# EAGLE design ePro (EAGLE 9.6.2)
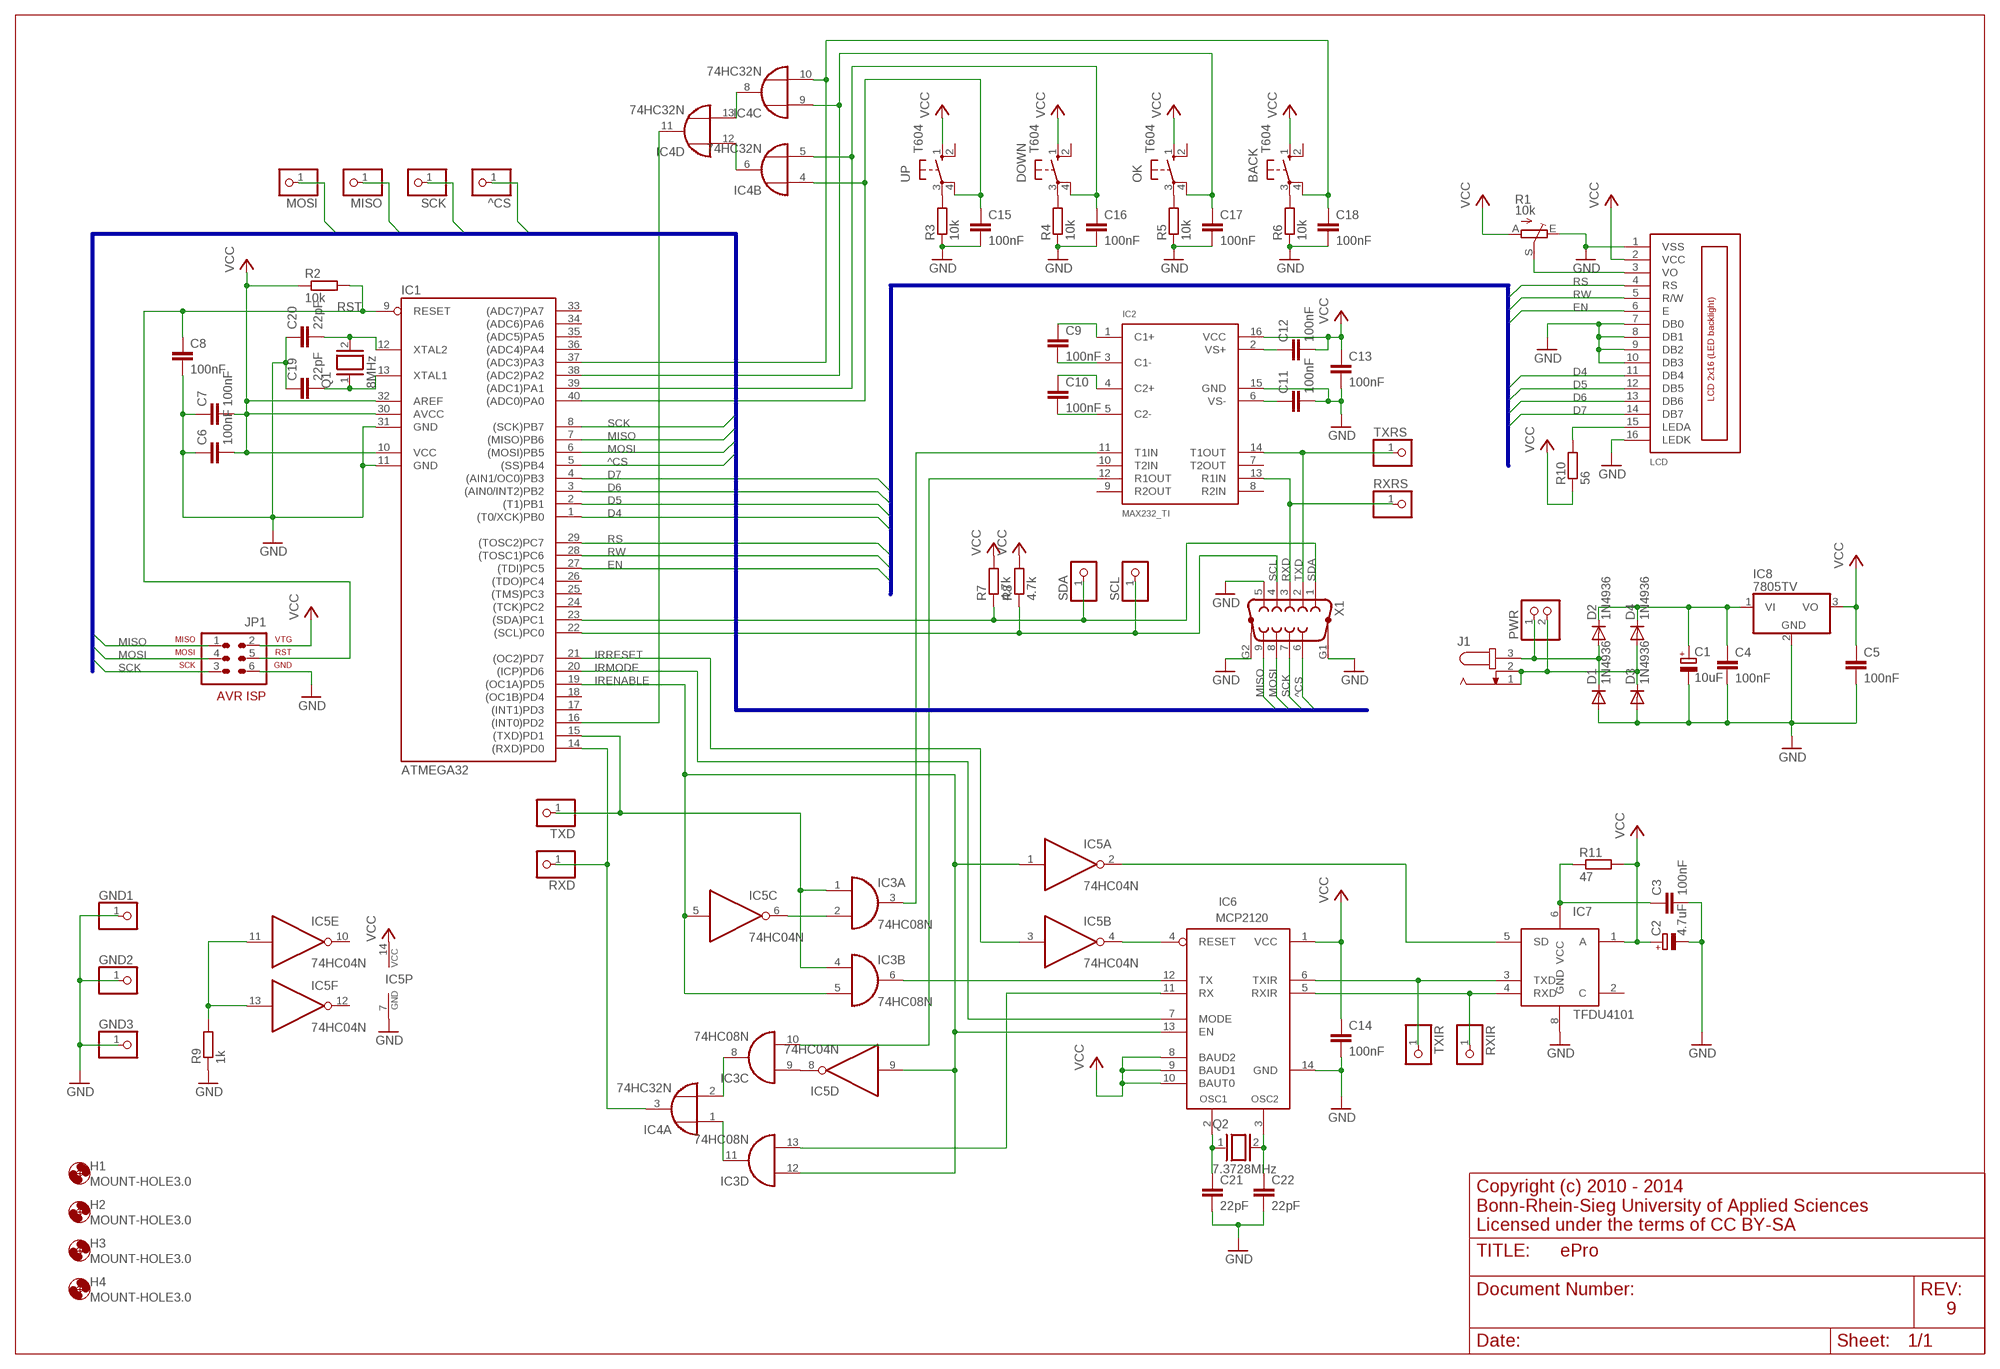
[diagram p0: schematic, sheet 1]

## Parts
^CS  PINHD-1X1  [1X01]
BACK  T604  [T602/604]
C1  10uF  CPOL-EUB45181B  [B45181B]
C2  4.7uF  CPOL-EUB45181B  [B45181B]
C3  100nF  C-EU025-024X044  [C025-024X044]
C4  100nF  C-EU025-024X044  [C025-024X044]
C5  100nF  C-EU025-024X044  [C025-024X044]
C6  100nF  C-EU025-024X044  [C025-024X044]
C7  100nF  C-EU025-024X044  [C025-024X044]
C8  100nF  C-EU025-024X044  [C025-024X044]
C9  100nF  C-EU025-024X044  [C025-024X044]
C10  100nF  C-EU025-024X044  [C025-024X044]
C11  100nF  C-EU025-024X044  [C025-024X044]
C12  100nF  C-EU025-024X044  [C025-024X044]
C13  100nF  C-EU025-024X044  [C025-024X044]
C14  100nF  C-EU025-024X044  [C025-024X044]
C15  100nF  C-EU025-024X044  [C025-024X044]
C16  100nF  C-EU025-024X044  [C025-024X044]
C17  100nF  C-EU025-024X044  [C025-024X044]
C18  100nF  C-EU025-024X044  [C025-024X044]
C19  22pF  C-EU025-024X044  [C025-024X044]
C20  22pF  C-EU025-024X044  [C025-024X044]
C21  22pF  C-EU025-024X044  [C025-024X044]
C22  22pF  C-EU025-024X044  [C025-024X044]
D1  1N4936  [DO41-10]
D2  1N4936  [DO41-10]
D3  1N4936  [DO41-10]
D4  1N4936  [DO41-10]
DOWN  T604  [T602/604]
GND1  PINHD-1X1  [1X01]
GND2  PINHD-1X1  [1X01]
GND3  PINHD-1X1  [1X01]
H1  MOUNT-HOLE3.0  [3,0]
H2  MOUNT-HOLE3.0  [3,0]
H3  MOUNT-HOLE3.0  [3,0]
H4  MOUNT-HOLE3.0  [3,0]
IC1  ATMEGA32  MEGA32-P  [DIL40]
IC2  MAX232_TI  [DIL16]
IC3  74HC08N  [DIL14]
IC4  74HC32N  [DIL14]
IC5  74HC04N  [DIL14]
IC6  MCP2120  MCP2120-P  [DIL14]
IC7  TFDU4101  [U]
IC8  7805TV  [TO220V]
J1  JACK-PLUG1  [SPC4078]
JP1  AVR-ISP-6  [AVR-ISP-6]
LCD  LCD_2X16_SIL  [HY-1602F]
MISO  PINHD-1X1  [1X01]
MOSI  PINHD-1X1  [1X01]
OK  T604  [T602/604]
PWR  PINHD-1X2  [1X02]
Q1  8MHz  XTAL/S  [QS]
Q2  7.3728MHz  XTAL/S  [QS]
R1  10k  TRIM_EU-PT10S  [PT-10S]
R2  10k  R-EU_0204/7  [0204/7]
R3  10k  R-EU_0204/7  [0204/7]
R4  10k  R-EU_0204/7  [0204/7]
R5  10k  R-EU_0204/7  [0204/7]
R6  10k  R-EU_0204/7  [0204/7]
R7  4.7k  R-EU_0204/7  [0204/7]
R8  4.7k  R-EU_0204/7  [0204/7]
R9  1k  R-EU_0204/7  [0204/7]
R10  56  R-EU_0204/7  [0204/7]
R11  47  R-EU_0204/7  [0204/7]
RXD  PINHD-1X1  [1X01]
RXIR  PINHD-1X1  [1X01]
RXRS  PINHD-1X1  [1X01]
SCK  PINHD-1X1  [1X01]
SCL  PINHD-1X1  [1X01]
SDA  PINHD-1X1  [1X01]
TXD  PINHD-1X1  [1X01]
TXIR  PINHD-1X1  [1X01]
TXRS  PINHD-1X1  [1X01]
UP  T604  [T602/604]
X1  F09HP  [F09HP]

## Nets
^CS: ^CS.1 IC1.5((SS)PB4) X1.6
D4: IC1.1((T0/XCK)PB0) LCD.11(DB4)
D5: IC1.2((T1)PB1) LCD.12(DB5)
D6: IC1.3((AIN0/INT2)PB2) LCD.13(DB6)
D7: IC1.4((AIN1/OC0)PB3) LCD.14(DB7)
EN: IC1.27((TDI)PC5) LCD.6(E)
GND: C1.- C2.- C3.2 C4.2 C5.2 C6.1 C7.1 C8.2 C11.2 C13.2 C14.2 C15.2 C16.2 C17.2 C18.2 C19.1 C20.1 C21.2 C22.2 D1.A D3.A GND1.1 GND2.1 GND3.1 IC1.11(GND) IC1.31(GND) IC2.15(GND) IC5.7(P:GND) IC6.14(GND) IC7.8(GND) IC8.2(GND) JP1.6 LCD.1(VSS) LCD.7(DB0) LCD.8(DB1) LCD.9(DB2) LCD.10(DB3) LCD.16(LEDK) R1.E R3.1 R4.1 R5.1 R6.1 R9.1 X1.5 X1.G1 X1.G2
IRENABLE: IC1.19((OC1A)PD5) IC3.5(B:I1) IC3.12(D:I0) IC5.1(A:I) IC5.5(C:I) IC5.9(D:I) IC6.13(EN)
IRMODE: IC1.20((ICP)PD6) IC6.7(MODE)
IRRESET: IC1.21((OC2)PD7) IC5.3(B:I)
IRSHUTDOWN: IC5.2(A:O) IC7.5(SD)
MISO: IC1.7((MISO)PB6) JP1.1 MISO.1 X1.9
MOSI: IC1.6((MOSI)PB5) JP1.4 MOSI.1 X1.8
N$1: IC1.15((TXD)PD1) IC3.1(A:I0) IC3.4(B:I0) TXD.1
N$2: C15.1 IC1.40((ADC0)PA0) IC4.4(B:I0) UP.4
N$3: IC3.2(A:I1) IC5.6(C:O)
N$4: IC4.6(B:O) IC4.12(D:I0)
N$6: IC6.5(RXIR) IC7.4(RXD) RXIR.1
N$7: C20.2 IC1.12(XTAL2) Q1.2
N$8: IC3.6(B:O) IC6.12(TX)
N$9: C21.1 IC6.2(OSC1) Q2.1
N$10: IC6.6(TXIR) IC7.3(TXD) TXIR.1
N$11: C16.1 DOWN.4 IC1.39((ADC1)PA1) IC4.5(B:I1)
N$12: C17.1 IC1.38((ADC2)PA2) IC4.9(C:I0) OK.4
N$13: IC2.12(R1OUT) IC3.10(C:I1)
N$14: C11.1 IC2.6(VS-)
N$15: C3.1 IC7.6(VCC) R11.1
N$16: LCD.3(VO) R1.S
N$17: IC5.4(B:O) IC6.4(RESET)
N$18: C22.1 IC6.3(OSC2) Q2.2
N$19: C10.2 IC2.5(C2-)
N$20: C19.2 IC1.13(XTAL1) Q1.1
N$21: IC3.13(D:I1) IC6.11(RX)
N$22: IC3.9(C:I0) IC5.8(D:O)
N$23: C1.+ C4.1 D2.C D4.C IC8.1(VI)
N$24: IC4.8(C:O) IC4.13(D:I1)
N$25: C10.1 IC2.4(C2+)
N$26: LCD.15(LEDA) R10.2
N$27: IC3.8(C:O) IC4.2(A:I1)
N$28: C9.2 IC2.3(C1-)
N$29: IC3.11(D:O) IC4.1(A:I0)
N$30: IC1.14((RXD)PD0) IC4.3(A:O) RXD.1
N$31: C9.1 IC2.1(C1+)
N$32: C12.1 IC2.2(VS+)
N$33: D3.C D4.A J1.1 J1.2 PWR.2
N$34: D1.C D2.A J1.3 PWR.1
N$35: BACK.3 R6.2
N$36: IC1.16((INT0)PD2) IC4.11(D:O)
N$37: BACK.4 C18.1 IC1.37((ADC3)PA3) IC4.10(C:I1)
N$38: IC2.11(T1IN) IC3.3(A:O)
N$39: OK.3 R5.2
N$40: DOWN.3 R4.2
N$41: R3.2 UP.3
N$42: IC5.11(E:I) IC5.13(F:I) R9.2
RS: IC1.29((TOSC2)PC7) LCD.4(RS)
RST: C8.1 IC1.9(RESET) JP1.5 R2.2
RW: IC1.28((TOSC1)PC6) LCD.5(R/W)
RXD: IC2.13(R1IN) RXRS.1 X1.3
SCK: IC1.8((SCK)PB7) JP1.3 SCK.1 X1.7
SCL: IC1.22((SCL)PC0) R8.1 SCL.1 X1.4
SDA: IC1.23((SDA)PC1) R7.1 SDA.1 X1.1
TXD: IC2.14(T1OUT) TXRS.1 X1.2
VCC: BACK.1 C2.+ C5.1 C6.2 C7.2 C12.2 C13.1 C14.1 DOWN.1 IC1.10(VCC) IC1.30(AVCC) IC1.32(AREF) IC2.16(VCC) IC5.14(P:VCC) IC6.1(VCC) IC6.8(BAUD2) IC6.9(BAUD1) IC6.10(BAUT0) IC7.1(A) IC8.3(VO) JP1.2 LCD.2(VCC) OK.1 R1.A R2.1 R7.2 R8.2 R10.1 R11.2 UP.1
Unconnected: BACK.2 DOWN.2 IC1.17((INT1)PD3) IC1.18((OC1B)PD4) IC1.24((TCK)PC2) IC1.25((TMS)PC3) IC1.26((TDO)PC4) IC1.33((ADC7)PA7) IC1.34((ADC6)PA6) IC1.35((ADC5)PA5) IC1.36((ADC4)PA4) IC2.7(T2OUT) IC2.8(R2IN) IC2.9(R2OUT) IC2.10(T2IN) IC5.10(E:O) IC5.12(F:O) IC7.2(C) OK.2 UP.2

## Buses
MISO,MOSI,SCK,^CS
D[4..7],RS,RW,EN

## Notes on the sheet
- Copyright (c) 2010 - 2014
  Bonn-Rhein-Sieg University of Applied Sciences
  Licensed under the terms of CC BY-SA
- 9

## Power pins joined to a net without a drawn wire
GND: IC3.7(P:GND) IC4.7(P:GND)
VCC: IC3.14(P:VCC) IC4.14(P:VCC)

## Library data of the parts
^CS GND1-GND3 MISO MOSI RXD RXIR RXRS SCK SCL SDA TXD TXIR TXRS = pinhead:PINHD-1X1: PIN HEADER
BACK DOWN OK UP = sporri:T604
C1 C2 = rcl:CPOL-EU: POLARIZED CAPACITOR, European symbol
C3-C18 = rcl:C-EU: CAPACITOR, European symbol
C19-C22 = resistor:C-EU: CAPACITOR, European symbol
D1-D4 = 1n4936:1N4936: DIODE fast recovery rectifier, 1A
H1-H4 = holes:MOUNT-HOLE: MOUNTING HOLE with drill center marker
IC1 = atmel:MEGA32-P: MICROCONTROLLER 32 Kbytes FLASH 2 Kbytes SRAM 1 Kbytes EEPROM USART 8-channel 10 bit ADC Source: www.atmel.com .. doc2503.pdf
IC2 = max232ti:MAX232_TI: MAX232, Texas Instruments Version
IC3 = 74xx-eu:74*08: Quad 2-input AND gate
IC4 = 74xx-eu:74*32: Quad 2-input OR gate
IC5 = 74xx-eu:74*04: Hex INVERTER
IC6 = microchip_mcp2120:MCP2120: Infrared Encoder/Decoder
IC7 = tfdu4101:TFDU4101
IC8 = linear:78*: Positive VOLTAGE REGULATOR Source: http://cache.national.com/ds/LM/LM78L05.pdf http://www.fairchildsemi.com/ds/LM/LM7805.pdf
J1 = con-jack:JACK-PLUG: DC POWER JACK Power Jack, DC, Right Angle, Through Hole, Rated 5A at 16VDC, PC Terminals Distributor: Farnell (www.Farnell.de) Drawing: 84N1161.pdf / 84N1162.pdf Manufacturer: SPC Technology (www.spctechnology.com) Type: SPC4077 / SPC 4078
JP1 = avr-4:AVR-ISP-6: AVR ISP-6 Serial Programming Header
LCD = lcd_2x16_led_backlight:LCD_2X16_SIL
PWR = pinhead:PINHD-1X2: PIN HEADER
Q1 Q2 = special:XTAL/S: CRYSTAL
R1 = pot:TRIM_EU-: POTENTIOMETER
R2 R10 R11 = rcl:R-EU_: RESISTOR, European symbol
R3-R9 = resistor:R-EU_: RESISTOR, European symbol
X1 = con-subd:F09HP: SUB-D

## Net classes
0 default: width 0.508 mm, clearance 0.152 mm

## Board
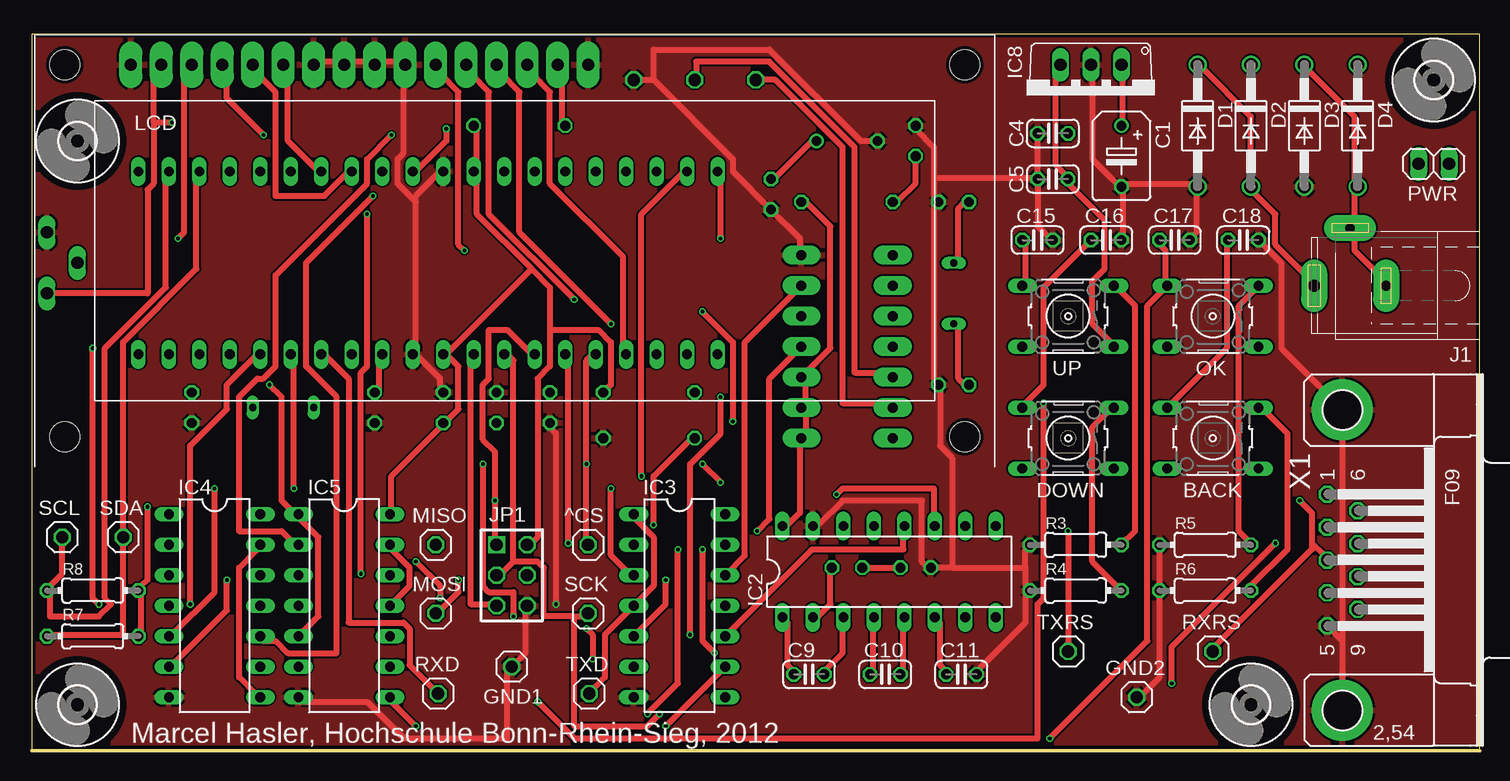
[diagram p1: board, top side]
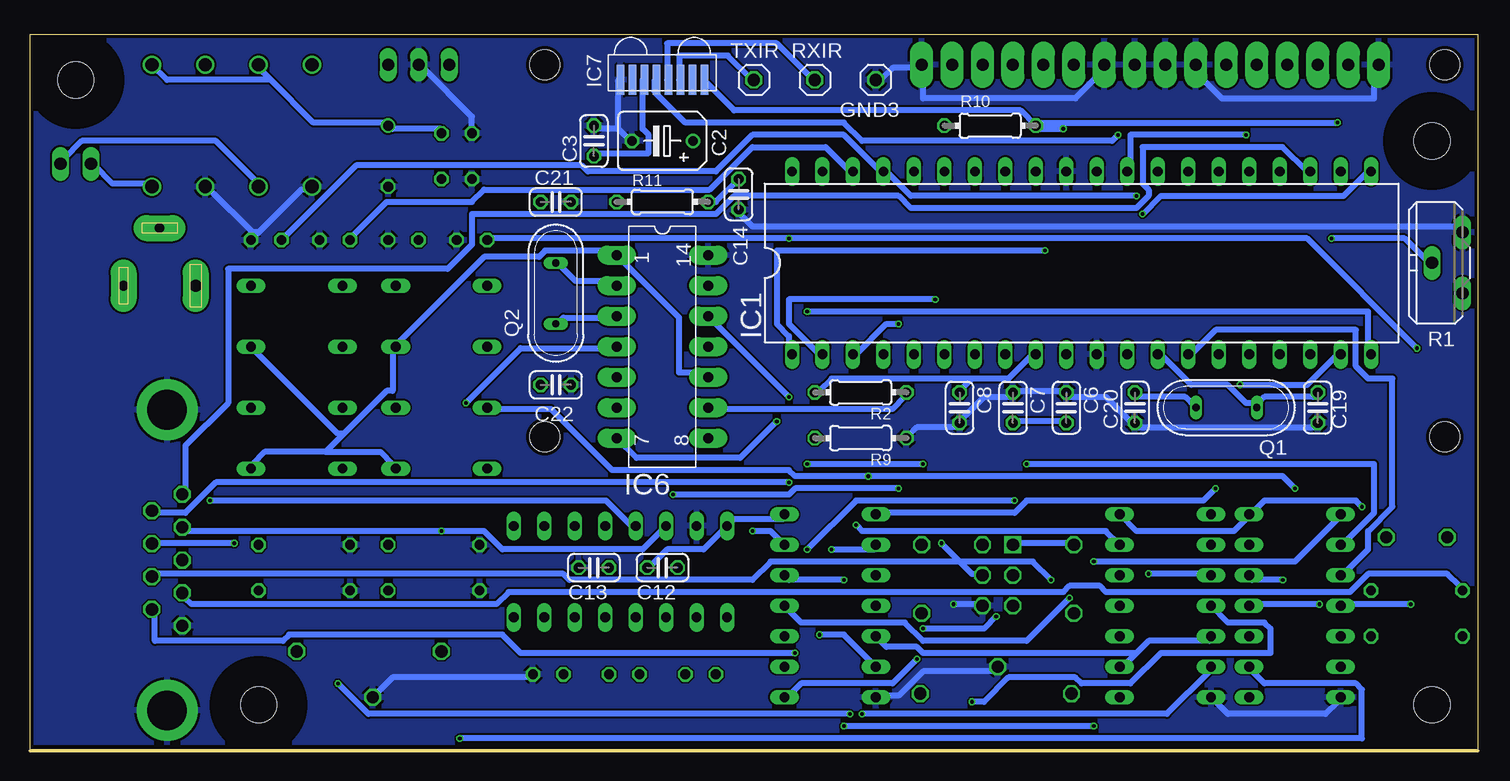
[diagram p2: board, bottom side, seen from below]

Size 120.65 x 59.69 mm. Coordinates in mm from the lower left corner, seen from the top.
Outline: 0,0 120.65,0 120.65,59.69 0,59.69 0,0
Copper layers (1*16): Top 0.035mm / dielectric 1.5mm / Bottom 0.035mm
Design rules "PCB-POOL HighSpec": minimum track width 0.125mm, minimum drill 0.2mm, track to track 0.125mm, track to pad 0.125mm, pad to pad 0.125mm, via to via 0.125mm, smd to smd 0.125mm, copper to edge 0.3mm, drill to drill 0.2mm, minimum pad ring 0.2mm, minimum via ring 0.125mm, stop-mask expansion 0.075mm, vias tented up to drill 0mil, thermal gap 0.2mm

### Footprints (pad centres in the part's own frame; a part is rotated, then mirrored left to right if it is on the bottom)
1X01 = drill 1.016 octagon: 1 0,0
T602/604 = drill 0.813 long: 1 -3.81,2.54; 2 3.81,2.54; 3 -3.81,-2.54; 4 3.81,-2.54
B45181B = drill 0.813: + -2.54,0 | drill 0.813 octagon: - 2.54,0
C025-024X044 = drill 0.813 octagon: 1 -1.27,0; 2 1.27,0
DO41-10 = drill 1.118: A 5.08,0; C -5.08,0
3,0 = hole 3: 0,0
DIL40 = drill 0.813 long: 1 -24.13,-7.62; 2 -21.59,-7.62; 3 -19.05,-7.62; 4 -16.51,-7.62; 5 -13.97,-7.62; 6 -11.43,-7.62; 7 -8.89,-7.62; 8 -6.35,-7.62; 9 -3.81,-7.62; 10 -1.27,-7.62; 11 1.27,-7.62; 12 3.81,-7.62; 13 6.35,-7.62; 14 8.89,-7.62; 15 11.43,-7.62; 16 13.97,-7.62; 17 16.51,-7.62; 18 19.05,-7.62; 19 21.59,-7.62; 20 24.13,-7.62; 21 24.13,7.62; 22 21.59,7.62; 23 19.05,7.62; 24 16.51,7.62; 25 13.97,7.62; 26 11.43,7.62; 27 8.89,7.62; 28 6.35,7.62; 29 3.81,7.62; 30 1.27,7.62; 31 -1.27,7.62; 32 -3.81,7.62; 33 -6.35,7.62; 34 -8.89,7.62; 35 -11.43,7.62; 36 -13.97,7.62; 37 -16.51,7.62; 38 -19.05,7.62; 39 -21.59,7.62; 40 -24.13,7.62
DIL16 = drill 0.813 long: 1 -8.89,-3.81; 2 -6.35,-3.81; 3 -3.81,-3.81; 4 -1.27,-3.81; 5 1.27,-3.81; 6 3.81,-3.81; 7 6.35,-3.81; 8 8.89,-3.81; 9 8.89,3.81; 10 6.35,3.81; 11 3.81,3.81; 12 1.27,3.81; 13 -1.27,3.81; 14 -3.81,3.81; 15 -6.35,3.81; 16 -8.89,3.81
DIL14 = drill 0.813 long: 1 -7.62,-3.81; 2 -5.08,-3.81; 3 -2.54,-3.81; 4 0,-3.81; 5 2.54,-3.81; 6 5.08,-3.81; 7 7.62,-3.81; 8 7.62,3.81; 9 5.08,3.81; 10 2.54,3.81; 11 0,3.81; 12 -2.54,3.81; 13 -5.08,3.81; 14 -7.62,3.81
DIL14' = drill 0.813 pad 1.6 long: 1 -7.62,-3.81; 2 -5.08,-3.81; 3 -2.54,-3.81; 4 0,-3.81; 5 2.54,-3.81; 6 5.08,-3.81; 7 7.62,-3.81; 8 7.62,3.81; 9 5.08,3.81; 10 2.54,3.81; 11 0,3.81; 12 -2.54,3.81; 13 -5.08,3.81; 14 -7.62,3.81
U = smd 0.6 x 2.5: 1 -3.5,0; 2 -2.5,0; 3 -1.5,0; 4 -0.5,0; 5 0.5,0; 6 1.5,0; 7 2.5,0; 8 3.5,0
TO220V = drill 1.016 long: 1 -2.54,-2.54; 2 0,-2.54; 3 2.54,-2.54
SPC4078 = drill 0.8 pad 2.184 long: 1 -3,0; 2 0,-4.8 | drill 1 pad 2.184 long: 3 3,0
AVR-ISP-6 = drill 1.016 square: 1 -2.54,-1.27 | drill 1.016 octagon: 2 -2.54,1.27; 3 0,-1.27; 4 0,1.27; 5 2.54,-1.27; 6 2.54,1.27
HY-1602F = drill 1 pad 1.93 long: 1 2.54,0; 2 5.08,0; 3 7.62,0; 4 10.16,0; 5 12.7,0; 6 15.24,0; 7 17.78,0; 8 20.32,0; 9 22.86,0; 10 25.4,0; 11 27.94,0; 12 30.48,0; 13 33.02,0; 14 35.56,0; 15 38.1,0; 16 40.64,0 | hole 2.5: -2.96,0; 72.04,0; -2.96,-31; 72.04,-31
1X02 = drill 1.016 long: 1 -1.27,0; 2 1.27,0
QS = drill 0.61 long: 1 -2.54,0; 2 2.54,0
PT-10S = drill 1.016 long: A -2.54,-1.27; E 2.54,-1.27; S 0,1.27
0204/7 = drill 0.813 octagon: 1 -3.81,0; 2 3.81,0
F09HP = drill 1.016 octagon: 1 -5.486,-1.27; 2 -2.743,-1.27; 3 0,-1.27; 4 2.743,-1.27; 5 5.486,-1.27; 6 -4.115,1.27; 7 -1.372,1.27; 8 1.372,1.27; 9 4.115,1.27 | drill 3.302 pad 5.08: G1 -12.522,0; G2 12.522,0

### Placement (x,y rotation side)
^CS  46.35,17.14 0 top
BACK  98.42,26.04 180 top
C1  90.81,49.53 270 top
C2  67.94,50.8 180 bottom
C3  73.66,50.8 90 bottom
C4  85.09,51.44 180 top
C5  85.09,47.62 180 top
C6  34.29,28.57 270 bottom
C7  38.73,28.57 270 bottom
C8  43.18,28.57 270 bottom
C9  64.77,6.35 0 top
C10  71.12,6.35 0 top
C11  77.47,6.35 0 top
C12  67.94,15.24 180 bottom
C13  73.66,15.24 180 bottom
C14  61.59,46.35 270 bottom
C15  83.82,42.55 0 top
C16  89.53,42.55 0 top
C17  95.25,42.55 0 top
C18  100.97,42.55 0 top
C19  13.34,28.57 90 bottom
C20  28.57,28.57 90 bottom
C21  76.83,45.72 0 bottom
C22  76.83,30.48 0 bottom
D1  97.16,52.07 270 top
D2  101.6,52.07 270 top
D3  106.05,52.07 270 top
D4  110.49,52.07 270 top
DOWN  86.36,26.04 180 top
GND1  40.01,6.99 180 top
GND2  92.08,4.45 0 top
GND3  50.16,55.88 180 bottom
H1  3.81,50.8 0 top
H2  116.84,55.88 0 top
H3  101.6,3.81 0 top
H4  3.81,3.81 0 top
IC1  33.02,40.64 0 bottom
IC2  71.45,14.91 0 top
IC3  53.98,12.06 270 top
IC4  15.24,12.06 270 top
IC5  26.04,12.06 270 top
IC6  MCP2120  [DIL14']  67.94,33.66 270 bottom
IC7  67.94,55.88 180 bottom
IC8  88.27,54.61 180 top
J1  109.86,38.73 180 top
JP1  40.01,14.61 270 top
LCD  5.71,57.15 0 top
MISO  33.66,17.14 0 top
MOSI  33.66,11.43 0 top
OK  98.42,36.2 180 top
PWR  116.84,48.9 180 top
Q1  20.95,28.57 180 bottom
Q2  76.83,38.1 270 bottom
R1  2.54,40.64 90 bottom
R2  51.44,29.84 180 bottom
R3  87,17.14 0 top
R4  87,13.34 0 top
R5  97.79,17.14 0 top
R6  97.79,13.34 0 top
R7  5.08,9.53 0 top
R8  5.08,13.34 0 top
R9  51.44,26.04 180 bottom
R10  40.64,52.07 180 bottom
R11  67.94,45.72 0 bottom
RXD  33.86,4.75 0 top
RXIR  55.24,55.88 0 bottom
RXRS  98.42,8.26 0 top
SCK  46.35,11.43 0 top
SCL  2.54,17.78 0 top
SDA  7.62,17.78 0 top
TXD  46.46,4.75 0 top
TXIR  60.33,55.88 0 bottom
TXRS  86.36,8.26 0 top
UP  86.36,36.2 180 top
X1  109.22,15.88 270 top

### Tracks (layer width: path | path; a pad name or v marks a point on that pad's centre or on a via)
^CS  (via drill 0.3)
  Top 0.508: IC1.5 46.74,33.02 46.23,32.51 v46.23,23.88 46.23,17.27 ^CS.1 | v55.88,23.88 v57.4,22.35
  Bottom 0.508: v57.4,22.35 105.16,22.35 107.7,19.81 110.24,19.81 X1.6 | v46.23,23.88 v55.88,23.88
D4  (via drill 0.3)
  Top 0.508: v36.07,41.66 35.56,42.16 35.56,54.86 34.04,56.39 34.04,56.9 LCD.11
  Bottom 0.508: v36.07,41.66 58.42,41.66 58.42,35.56 57.4,34.54 57.4,33.02 IC1.1
D5  (via drill 0.3)
  Top 0.508: v45.21,37.59 38.1,44.7 38.1,54.86 36.58,56.39 36.58,56.9 LCD.12
  Bottom 0.508: v45.21,37.59 57.4,37.59 57.4,35.56 54.86,33.02 IC1.2
D6  (via drill 0.3)
  Top 0.508: v48.26,35.56 40.64,43.18 40.64,54.86 39.12,56.39 39.12,56.9 LCD.13
  Bottom 0.508: v48.26,35.56 49.28,35.56 51.82,33.02 IC1.3
D7
  Top 0.508: IC1.4 49.28,33.02 49.28,41.15 43.18,47.24 43.18,54.86 41.66,56.39 41.66,56.9 LCD.14
EN
  Top 0.508: IC1.27 23.88,48.26 21.34,50.8 21.34,56.9 LCD.6
GND  (via drill 0.3)
  Top 0.508: 109.22,9.14 108.2,10.16 X1.5 | 109.22,9.14 X1.G2 | 109.22,9.14 X1.G1 109.22,28.45 104.14,33.53 104.14,40.64 C18.2 | R5.1 R6.1 93.98,6.1 92.46,4.57 GND2.1 | C11.2 78.74,6.6 82.8,10.67 82.8,13.21 R4.1 82.8,13.72 82.8,15.24 | 76.71,15.24 82.8,15.24 | 82.8,15.24 82.8,16.76 R3.1 | 76.71,15.24 C13.2 74.68,15.24 74.17,15.75 74.17,20.83 67.56,20.83 65.53,18.8 IC2.15 | C16.2 90.93,42.67 90.93,46.74 C1.- | C17.2 96.52,42.67 97.03,43.18 97.03,46.74 D1.A 97.03,47.24 90.93,47.24 C1.- | C15.2 84.84,42.67 83.82,43.69 C5.2 83.82,47.75 | 83.82,47.75 C4.2 | 75.18,45.72 75.18,30.48 C22.2 75.69,30.48 75.69,25.4 76.71,24.38 76.71,15.24 | 75.18,47.75 75.18,45.72 | 75.18,47.75 75.18,50.29 73.66,51.82 C3.2 | 75.18,45.72 C21.2 | 75.18,47.75 83.82,47.75 | C1.- 90.42,47.24 88.39,49.28 88.39,56.9 IC8.2 | IC6.14 64.01,41.66 64.01,42.67 C14.2 58.42,48.26 58.42,49.28 51.82,55.88 | JP1.6 41.15,11.68 41.15,8.13 GND1.1 39.62,6.6 39.62,1.02 30.99,1.02 27.94,4.06 22.35,4.06 IC5.7 | LCD.7 23.88,57.4 25.91,57.4 LCD.8 26.42,57.4 28.45,57.4 LCD.9 28.96,57.4 30.99,57.4 LCD.10 30.99,56.9 30.99,49.78 30.48,49.28 30.48,47.24 32,45.72 | 32,33.02 34.04,30.99 34.04,29.97 C6.1 | 32,33.02 32,45.72 | 32,45.72 32,46.23 34.04,48.26 IC1.31 | 32,33.02 IC1.11 | v43.69,12.19 43.69,26.42 43.18,26.92 C8.2 | GND3.1 51.82,55.88 | 51.82,55.88 51.82,58.42 61.47,58.42 69.09,50.8 C2.-
  Bottom 0.508: GND2.1 90.42,6.1 78.74,6.1 C11.2 | 101.6,43.18 98.04,46.74 97.54,46.74 D1.A | 101.6,43.18 C18.2 | 101.6,43.18 102.11,43.18 105.66,46.74 D3.A | IC8.2 87.88,56.9 83.82,52.83 C4.2 | 71.63,51.82 70.61,50.8 C2.- | 71.63,51.82 73.66,51.82 C3.2 | 71.63,51.82 71.63,55.88 IC7.8 | R1.E 1.52,43.18 2.03,43.69 60.45,43.69 61.47,44.7 C14.2 | IC4.7 11.68,4.06 12.7,3.05 20.83,3.05 IC5.7 | IC3.7 49.78,4.57 48.26,4.57 46.23,6.6 40.13,6.6 GND1.1 | LCD.1 8.64,56.9 8.64,54.36 21.34,54.36 23.88,56.9 LCD.7 | GND3.1 49.78,55.88 48.77,56.9 46.74,56.9 LCD.16 46.23,56.9 46.23,54.36 33.53,54.36 30.99,56.9 LCD.10 | C19.1 13.72,26.92 28.45,26.92 C20.1 28.96,27.43 30.99,29.46 34.04,29.46 C6.1 34.54,29.97 38.61,29.97 C7.1 39.12,29.46 41.15,29.46 43.18,27.43 C8.2 43.18,26.92 46.74,26.92 R9.1 | v43.69,12.19 41.66,12.19 JP1.6
  pour Top: 0,0 120.65,0 120.65,59.69 0,59.69
  pour Bottom: 0,0 120.65,0 120.65,59.69 0,59.69
IRENABLE  (via drill 0.3)
  Top 0.508: IC3.12 59.44,16.26 59.44,34.04 IC6.13 | IC5.5 23.88,11.18 23.88,17.78 22.35,19.3 IC5.1 21.84,19.81 20.83,20.83 20.83,29.46 v19.81,30.48 | v52.83,14.22 52.83,12.19 IC3.5
  Bottom 0.508: 28.45,8.13 29.46,7.11 IC5.9 | 28.45,8.13 27.43,9.14 22.35,9.14 IC5.5 | v19.81,30.48 14.22,30.48 11.68,33.02 IC1.19 | 28.45,8.13 46.23,8.13 46.74,8.64 49.28,8.64 IC3.5 | v52.83,14.22 57.4,14.22 IC3.12
IRMODE  (via drill 0.3)
  Top 0.508: v55.88,36.58 58.42,34.04 v58.42,27.43
  Bottom 0.508: v55.88,36.58 9.14,36.58 9.14,33.02 IC1.20 | v58.42,27.43 61.47,24.38 70.1,24.38 IC6.7
IRRESET  (via drill 0.3)
  Top 0.508: v27.43,14.73 27.43,31.5 27.94,32 v27.94,44.7
  Bottom 0.508: v27.43,14.73 22.35,14.73 IC5.3 | v27.94,44.7 26.42,46.23 11.18,46.23 9.14,48.26 IC1.21
IRSHUTDOWN  (via drill 0.3)
  Top 0.508: v29.97,51.31 27.94,49.28 27.94,47.24 20.32,39.62 20.32,32 19.3,30.99 18.8,30.99 17.27,29.46 17.27,18.29 20.83,18.29 21.84,17.27 IC5.2
  Bottom 0.508: v29.97,51.31 30.48,50.8 51.31,50.8 52.83,52.32 66.04,52.32 68.58,54.86 68.58,55.88 IC7.5
MISO  (via drill 0.3)
  Top 0.508: IC1.7 41.66,33.02 39.62,35.05 38.1,35.05 38.1,30.99 37.59,30.48 37.59,25.91 38.61,24.89 v38.61,20.83 38.61,17.27 JP1.1 | v56.9,8.13 55.88,9.14 v55.88,16.76
  Bottom 0.508: v56.9,8.13 79.76,8.13 81.28,9.65 99.06,9.65 99.57,9.14 110.24,9.14 110.24,11.68 X1.9 | v55.88,16.76 51.82,20.83 v38.61,20.83 | MISO.1 34.04,17.27 38.61,17.27 JP1.1
MOSI  (via drill 0.3)
  Top 0.508: v44.7,17.27 44.7,33.02 IC1.6 | v35.56,14.22 35.56,13.21 34.04,11.68 MOSI.1
  Bottom 0.508: 43.18,15.75 42.16,14.73 41.66,14.73 JP1.4 | 43.18,15.75 v44.7,17.27 | v35.56,14.22 37.08,15.75 43.18,15.75 | 43.18,15.75 58.93,15.75 60.45,14.22 75.69,14.22 76.2,14.73 110.24,14.73 X1.8
N$1  (via drill 0.3)
  Top 0.508: TXD.1 46.74,5.08 47.75,6.1 47.75,9.65 IC3.4 51.82,13.72 51.82,17.78 50.29,19.3 IC3.1 | v21.84,21.84 21.84,33.02 IC1.15
  Bottom 0.508: v21.84,21.84 22.86,20.83 37.59,20.83 38.61,19.81 49.78,19.81 IC3.1
N$2  (via drill 0.3)
  Top 0.508: v5.59,12.19 5.08,12.7 v5.08,33.53 | UP.4 82.8,39.12 82.8,42.16 C15.1 | v57.4,42.67 57.4,48.26 IC1.40
  Bottom 0.508: v5.59,12.19 11.18,12.19 IC4.4 | v5.08,33.53 14.22,42.67 v57.4,42.67 82.3,42.67 C15.1
N$3  (via drill 0.3)
  Top 0.508: v51.31,3.05 53.85,5.59 v53.85,16.76
  Bottom 0.508: v51.31,3.05 25.91,3.05 22.35,6.6 IC5.6 | v53.85,16.76 50.29,16.76 IC3.2
N$4  (via drill 0.3)
  Top 0.508: v16.26,14.22 16.26,11.68 11.68,7.11 IC4.6
  Bottom 0.508: v16.26,14.22 18.8,14.22 IC4.12
N$6
  Top 0.508: IC6.5 71.63,31.5 68.58,31.5 68.58,50.29 61.47,57.4 55.37,57.4 55.37,55.88 RXIR.1
  Bottom 0.508: IC7.4 67.56,55.88 67.56,58.93 58.42,58.93 55.37,55.88 RXIR.1
N$7
  Top 0.508: IC1.12 28.96,33.02 28.96,29.97 C20.2
  Bottom 0.508: Q1.2 24.38,29.46 28.45,29.46 C20.2
N$8  (via drill 0.3)
  Top 0.508: v54.86,9.65 54.86,23.88 57.4,26.42 v57.4,29.46
  Bottom 0.508: v54.86,9.65 52.83,9.65 IC3.6 | v57.4,29.46 IC6.12
N$9
  Top 0.508: C21.1 77.72,45.72 77.22,45.21 77.22,40.64 Q2.1
  Bottom 0.508: Q2.1 76.71,40.64 75.18,39.12 72.14,39.12 IC6.2
N$10
  Top 0.508: IC6.6 71.63,28.96 67.56,28.96 67.56,50.29 61.98,55.88 TXIR.1
  Bottom 0.508: IC7.3 66.55,55.88 66.55,57.91 62.48,57.91 60.45,55.88 TXIR.1
N$11  (via drill 0.3)
  Top 0.508: v15.24,21.84 15.24,13.21 11.68,9.65 IC4.5 | C16.1 84.33,38.61 84.33,30.48 82.8,28.96 DOWN.4 | v50.8,22.86 50.8,44.7 54.36,48.26 IC1.39
  Bottom 0.508: v15.24,21.84 16.26,22.86 v50.8,22.86 56.9,22.86 57.4,23.37 72.14,23.37 77.22,28.45 82.3,28.45 DOWN.4
N$12  (via drill 0.3)
  Top 0.508: v84.84,1.02 92.96,9.14 92.96,37.08 OK.4 94.49,39.12 94.49,41.66 93.98,42.16 C17.1
  Bottom 0.508: v84.84,1.02 9.65,1.02 9.65,5.08 10.16,5.59 17.78,5.59 18.8,6.6 IC4.9 | IC1.38 52.32,48.26 54.36,50.29 60.45,50.29 64.01,46.74 82.8,46.74 83.82,45.72 90.93,45.72 93.98,42.67 C17.1
N$13
  Top 0.508: IC3.10 65.02,16.76 72.64,16.76 72.64,18.29 IC2.12
N$14
  Top 0.508: C11.1 76.2,6.6 75.69,7.11 75.69,10.67 IC2.6
N$15
  Top 0.508: R11.1 72.14,45.72 73.66,47.24 C3.1
  Bottom 0.508: IC7.6 69.6,55.88 69.6,51.82 69.09,51.31 69.09,49.78 73.66,49.78 C3.1
N$16  (via drill 0.3)
  Top 0.508: v12.19,42.67 12.7,43.18 12.7,56.39 13.21,56.9 LCD.3
  Bottom 0.508: v12.19,42.67 6.1,42.67 4.06,40.64 R1.S
N$17  (via drill 0.3)
  Top 0.508: v42.16,4.06 45.21,1.02 83.82,1.02 83.82,12.19 84.33,12.7 v84.33,28.96
  Bottom 0.508: v42.16,4.06 41.15,4.06 39.12,6.1 33.53,6.1 33.02,5.59 28.96,5.59 26.42,8.13 17.27,8.13 17.27,10.16 17.78,10.67 20.83,10.67 IC5.4 | v84.33,28.96 79.76,33.53 72.14,33.53 IC6.4
N$18
  Top 0.508: C22.1 77.72,30.48 77.22,30.99 77.22,35.56 Q2.2
  Bottom 0.508: Q2.2 76.71,35.56 76.2,36.07 72.14,36.07 IC6.3
N$19
  Top 0.508: C10.2 72.64,6.6 72.64,10.67 IC2.5
N$20
  Bottom 0.508: C19.2 13.72,29.46 17.78,29.46 18.29,28.96 Q1.1 18.8,28.96 19.3,28.96 20.83,30.48 23.88,30.48 26.42,33.02 IC1.13
N$21  (via drill 0.3)
  Top 0.508: v60.45,18.29 61.47,19.3 61.47,30.99 IC6.11
  Bottom 0.508: v60.45,18.29 58.93,18.29 IC3.13
N$22  (via drill 0.3)
  Top 0.508: v32,2.03 29.97,4.06 IC5.8 | v52.83,2.03 IC3.9
  Bottom 0.508: v32,2.03 v52.83,2.03
N$23
  Top 0.508: IC8.1 90.93,56.9 90.93,52.32 C1.+
  Bottom 0.508: C4.1 86.36,51.82 90.42,51.82 C1.+ 90.93,52.32 97.03,52.32 100.58,55.88 | 100.58,55.88 101.6,56.9 D2.C | 100.58,55.88 109.22,55.88 D4.C
N$24
  Top 0.508: IC4.8 18.8,4.57 17.27,6.1 17.27,15.24 18.8,16.76 IC4.13
N$25
  Top 0.508: C10.1 70.1,6.6 70.1,10.67 IC2.4
N$26
  Top 0.508: R10.2 44.2,52.32 44.2,56.9 LCD.15
N$27  (via drill 0.3)
  Top 0.508: v37.59,23.88 37.59,13.72 38.1,13.21 40.13,13.21 v40.13,11.18 | v46.23,10.16 46.74,9.65 v46.74,7.62
  Bottom 0.508: v37.59,23.88 8.64,23.88 8.64,19.81 11.18,17.27 IC4.2 | v40.13,11.18 41.15,10.16 v46.23,10.16 | v46.74,7.62 48.77,5.59 56.39,5.59 57.4,4.57 IC3.8
N$28
  Top 0.508: C9.2 66.04,6.6 67.56,8.13 67.56,10.67 IC2.3
N$29  (via drill 0.3)
  Top 0.508: v32,15.75 34.04,13.72 v34.04,12.7
  Bottom 0.508: v32,15.75 15.24,15.75 11.68,19.3 IC4.1 | v34.04,12.7 37.59,9.14 46.23,9.14 47.75,10.67 56.39,10.67 IC3.11
N$30
  Top 0.508: RXD.1 31.5,7.11 31.5,10.16 30.99,10.67 26.42,10.67 26.42,30.99 24.38,33.02 IC1.14
  Bottom 0.508: IC4.3 11.18,14.73 9.14,16.76 9.14,18.29 7.11,20.32 7.11,30.99 9.14,30.99 10.16,32 10.16,35.05 21.84,35.05 23.88,33.02 IC1.14
N$31
  Top 0.508: C9.1 63.5,6.6 62.99,7.11 62.99,10.67 IC2.1
N$32
  Top 0.508: IC2.2 65.53,11.18 66.55,12.19 66.55,15.24 C12.1
N$33
  Top 0.508: D3.C 106.17,56.9 110.24,52.83 110.24,47.24 D4.A 110.24,46.74 110.24,43.69 J1.2 110.24,43.18 110.24,41.66 112.78,39.12 J1.1
  Bottom 0.508: PWR.2 115.32,48.77 113.79,47.24 110.74,47.24 D4.A
N$34
  Top 0.508: D1.C 97.54,56.9 101.6,52.83 D2.A 101.6,46.74 103.63,44.7 103.63,42.16 106.68,39.12 J1.3
  Bottom 0.508: PWR.1 117.86,49.28 116.33,50.8 105.16,50.8 101.6,47.24 D2.A
N$35
  Top 0.508: R6.2 101.6,13.72 104.65,16.76 104.65,26.42 102.62,28.45 BACK.3
N$36  (via drill 0.3)
  Top 0.508: v13.21,12.19 13.21,25.4 16.26,28.45 16.26,30.48 18.8,33.02 IC1.16
  Bottom 0.508: v13.21,12.19 18.8,12.19 IC4.11
N$37  (via drill 0.3)
  Top 0.508: BACK.4 99.57,33.53 99.57,42.16 C18.1 | v28.45,46.23 22.86,40.64 22.86,32 25.4,29.46 25.4,8.13 21.34,8.13 20.32,9.14 19.3,9.14 IC4.10
  Bottom 0.508: v28.45,46.23 47.24,46.23 49.28,48.26 IC1.37 49.78,48.26 52.83,51.31 60.45,51.31 63.5,48.26 74.17,48.26 74.68,48.77 93.47,48.77 C18.1
N$38  (via drill 0.3)
  Top 0.508: v48.26,21.84 48.26,16.26 49.78,14.73 IC3.3 | v67.06,21.34 67.56,21.84 75.18,21.84 75.18,18.8 IC2.11
  Bottom 0.508: v48.26,21.84 56.9,21.84 57.4,21.34 v67.06,21.34
N$39
  Top 0.508: R5.2 101.6,17.27 100.58,18.29 100.58,37.08 OK.3
N$40
  Top 0.508: R4.2 88.39,15.75 88.39,26.92 89.92,28.45 DOWN.3
N$41
  Top 0.508: R3.2 91.95,18.29 91.95,37.08 90.42,38.61 UP.3
N$42  (via drill 0.3)
  Top 0.508: IC5.11 31.5,13.72 31.5,15.24 29.97,16.76 IC5.13 | v51.82,18.8 51.82,22.86 54.86,25.91 R9.2
  Bottom 0.508: v51.82,18.8 51.31,18.29 30.99,18.29 IC5.13
RS  (via drill 0.3)
  Top 0.508: v19.3,51.31 16.26,54.36 16.26,56.9 LCD.4
  Bottom 0.508: v19.3,51.31 28.96,51.31 28.96,48.26 IC1.29
RST
  Top 0.508: JP1.5 38.61,12.19 36.58,12.19 36.58,33.02 IC1.9
  Bottom 0.508: 42.16,30.99 43.18,29.97 C8.1 | 42.16,30.99 39.12,30.99 37.08,33.02 IC1.9 | 42.16,30.99 53.85,30.99 54.86,29.97 R2.2
RW
  Top 0.508: IC1.28 26.42,48.26 24.38,46.23 20.32,46.23 20.32,54.86 18.8,56.39 18.8,56.9 LCD.5
RXD  (via drill 0.3)
  Top 0.508: v105.66,20.83 106.68,19.81 106.68,17.27 | 106.68,17.27 107.7,16.26 X1.3 | 106.68,17.27 106.68,16.76 98.55,8.64 RXRS.1
  Bottom 0.508: v105.66,20.83 72.64,20.83 70.61,18.8 IC2.13
SCK  (via drill 0.3)
  Top 0.508: 40.13,15.75 40.13,32.51 39.62,33.02 IC1.8 | 40.13,15.75 39.12,14.73 JP1.3 | 45.21,11.18 42.67,11.18 42.67,15.24 42.16,15.75 40.13,15.75 | 45.21,11.18 46.23,11.18 SCK.1 | v103.63,17.27 95,8.64 v95,5.59 | v52.32,3.05 51.31,2.03 45.21,2.03 45.21,11.18
  Bottom 0.508: v103.63,17.27 110.24,17.27 X1.7 | v95,5.59 92.46,3.05 v52.32,3.05
SCL
  Top 0.508: SCL.1 2.54,14.73 1.52,13.72 R8.1 1.52,13.21 1.52,11.18 5.59,11.18 6.6,12.19 6.1,12.7 6.1,33.53 11.18,38.61 11.18,48.26 IC1.22
  Bottom 0.508: X1.4 107.7,12.7 107.19,12.19 81.79,12.19 80.77,13.21 34.54,13.21 34.04,13.72 31.5,13.72 30.99,13.21 10.67,13.21 9.14,14.73 2.54,14.73 1.52,13.72 R8.1
SDA
  Top 0.508: R7.1 1.52,9.65 7.62,9.65 SDA.1 7.62,34.04 13.72,40.13 13.72,48.26 IC1.23
  Bottom 0.508: X1.1 107.7,21.84 107.7,25.4 104.14,28.96 104.14,40.13 85.85,40.13 83.82,42.16 83.82,44.7 63.5,44.7 61.98,46.23 48.26,46.23 47.24,45.21 28.45,45.21 27.43,46.23 27.43,46.74 27.94,47.24 27.94,50.29 16.26,50.29 14.22,48.26 IC1.23
TXD  (via drill 0.3)
  Top 0.508: v86.36,18.29 TXRS.1
  Bottom 0.508: IC2.14 69.6,16.76 81.28,16.76 82.8,18.29 v86.36,18.29 107.7,18.29 X1.2
VCC  (via drill 0.3)
  Top 0.508: IC8.3 85.34,56.9 85.34,48.77 86.36,47.75 C5.1 86.36,47.24 89.41,44.2 89.41,40.13 88.39,39.12 88.39,35.56 89.92,34.04 UP.1 | C12.2 C13.1 | C2.+ 65.02,50.8 61.98,47.75 C14.1 | R11.2 64.52,45.72 66.55,43.69 66.55,33.53 IC6.10 64.52,30.99 64.52,28.96 IC6.9 64.52,28.45 64.52,26.42 IC6.8 64.01,25.91 64.01,19.81 62.99,18.8 IC2.16 | 34.54,33.02 35.56,32 35.56,28.45 34.54,27.43 C6.2 34.04,26.92 29.97,22.86 29.97,19.81 IC5.14 | R7.2 9.14,9.65 9.14,13.21 R8.2 9.14,13.72 9.65,14.22 v9.65,20.32 | 10.16,52.32 10.16,56.39 10.67,56.9 LCD.2 | 10.16,52.32 10.16,47.24 9.65,46.74 9.65,38.1 R1.A | v34.54,51.82 34.54,50.8 32,48.26 IC1.30 | 37.08,48.26 37.08,51.82 R10.1 | 43.18,35.05 43.18,38.61 41.66,40.13 | 43.18,35.05 43.18,32 42.16,30.99 42.16,17.78 41.66,17.27 JP1.2 | 41.66,40.13 37.08,44.7 37.08,48.26 | 37.08,48.26 IC1.32 | v11.68,52.32 10.16,52.32 | 34.54,33.02 41.66,40.13 | 34.54,33.02 IC1.10 | 43.18,35.05 47.24,35.05 48.26,34.04 48.26,30.48 R2.1
  Bottom 0.508: 96.01,24.89 101.09,24.89 102.11,23.88 BACK.1 | 96.01,24.89 91.44,24.89 90.42,23.88 DOWN.1 | 94.49,26.42 96.01,24.89 | 94.49,26.42 90.93,29.97 90.42,29.97 90.42,33.53 UP.1 89.92,34.04 82.8,41.15 78.23,41.15 77.72,41.66 72.14,41.66 IC6.1 66.55,36.07 66.55,31.5 64.52,31.5 IC6.10 | 94.49,26.42 95,26.42 OK.1 | IC3.14 57.91,19.3 61.98,19.3 IC2.16 64.52,16.76 67.56,16.76 69.09,15.24 C12.2 | C14.1 63.5,45.72 R11.2 | R2.1 47.75,29.46 48.77,28.45 64.01,28.45 IC6.9 | C6.2 34.54,27.43 38.61,27.43 C7.2 | IC5.14 28.45,18.29 20.32,18.29 19.3,19.3 IC4.14 18.8,19.81 17.78,20.83 10.16,20.83 v9.65,20.32 | v34.54,51.82 36.58,51.82 R10.1 | IC7.1 64.52,55.88 61.98,53.34 38.1,53.34 R10.1 | v11.68,52.32 36.58,52.32 R10.1

### Text on the board
tNames: Marcel Hasler, Hochschule Bonn-Rhein-Sieg, 2012